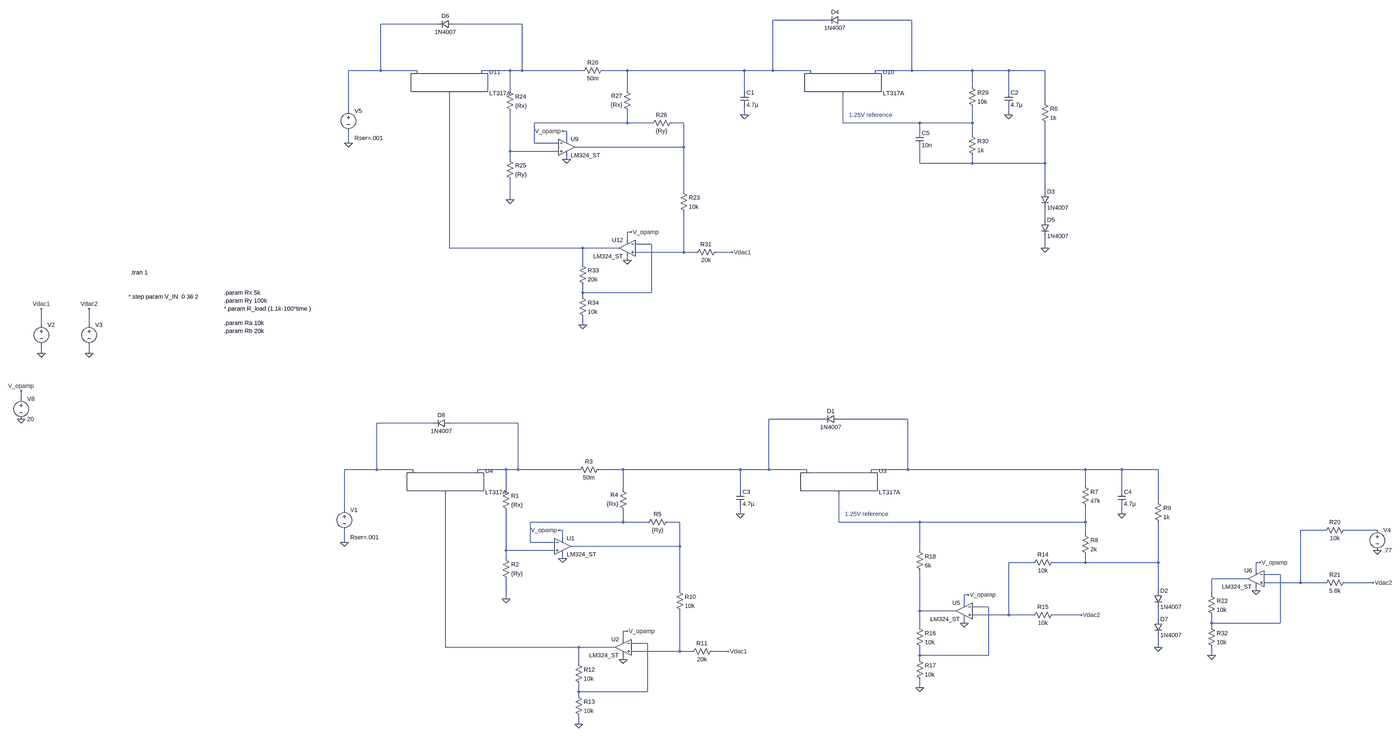
[diagram p0: schematic LDO2.asc, whole sheet]
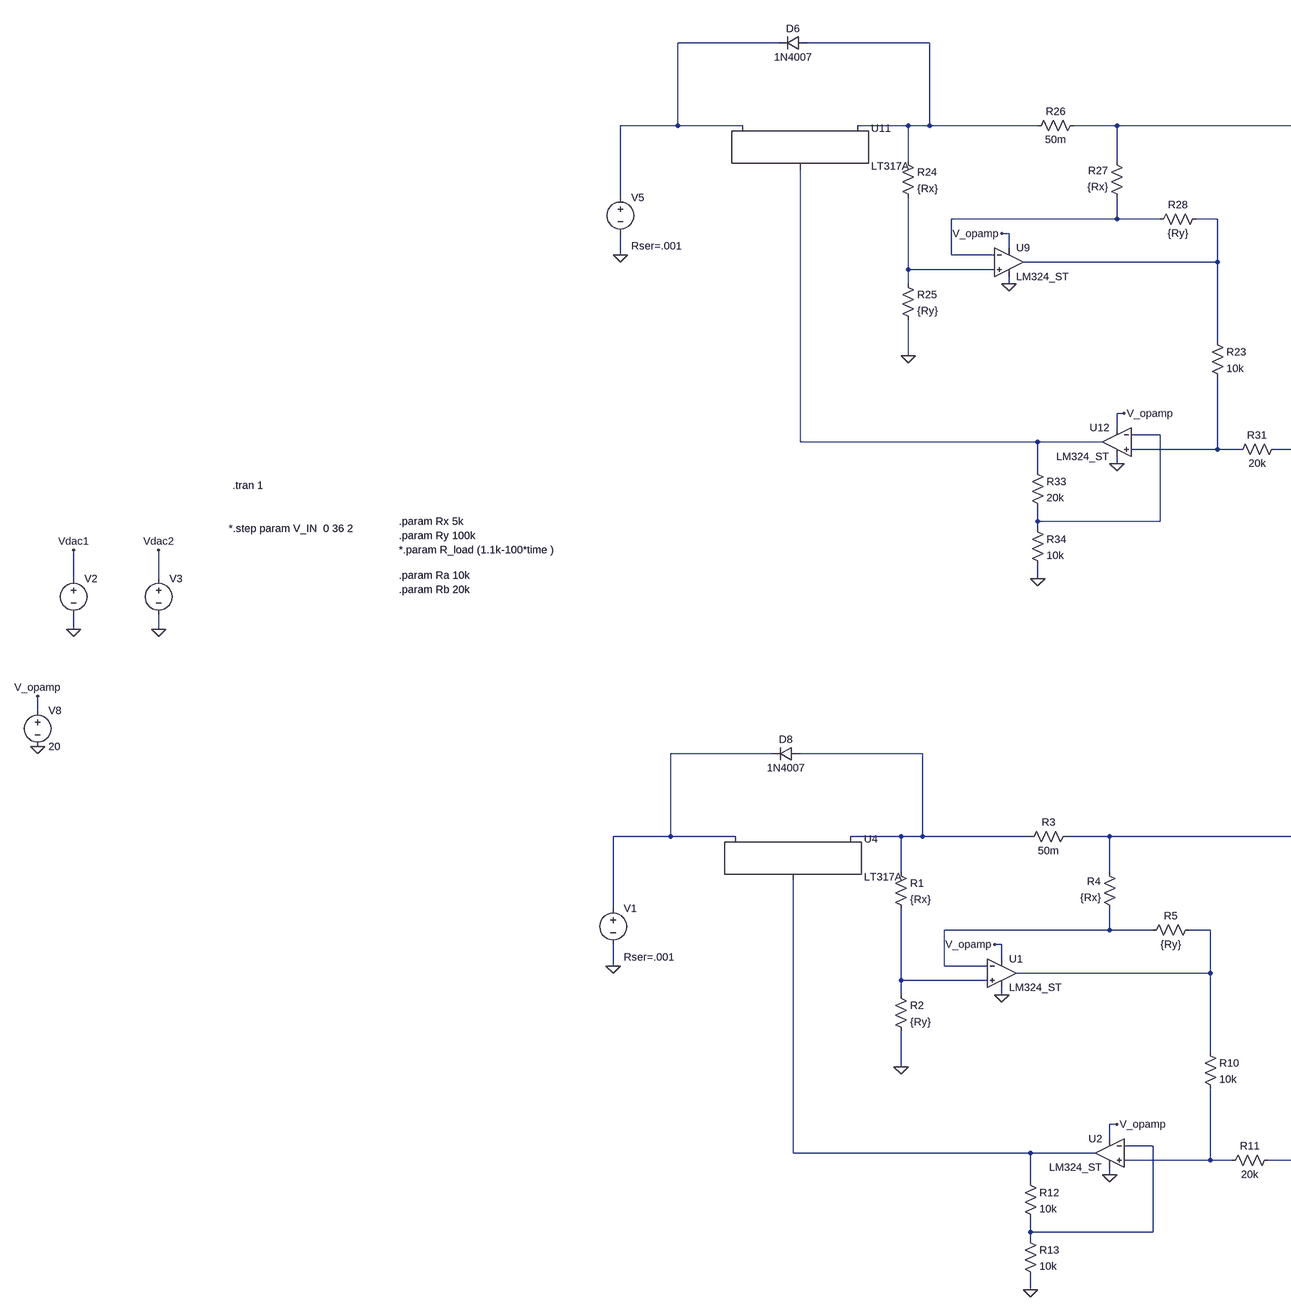
[diagram p1: schematic LDO2.asc, part, row 1 of 1, column 1 of 2]
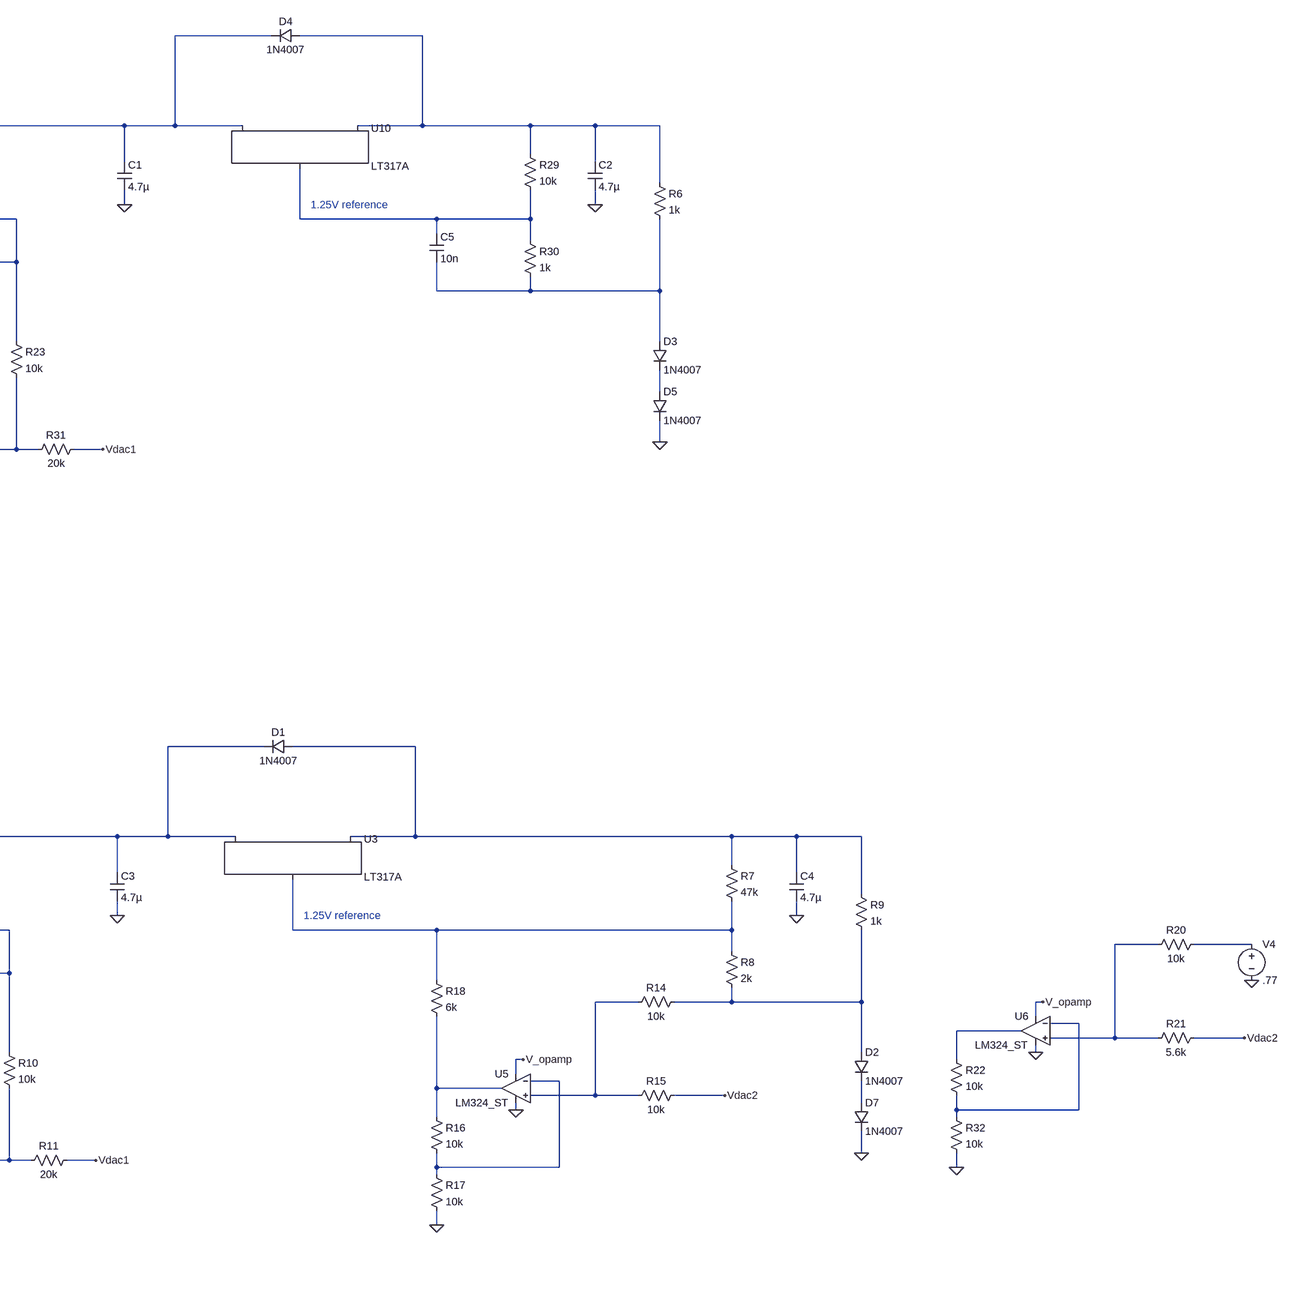
[diagram p2: schematic LDO2.asc, part, row 1 of 1, column 2 of 2]
LDO2.asc, the LTspice schematic file:
Version 4
SHEET 1 14016 4660
WIRE 3968 -384 3744 -384
WIRE 4304 -384 4032 -384
WIRE 2416 -368 2192 -368
WIRE 2752 -368 2480 -368
WIRE 2192 -144 2192 -368
WIRE 2192 -144 2064 -144
WIRE 2336 -144 2192 -144
WIRE 2704 -144 2592 -144
WIRE 2752 -144 2752 -368
WIRE 2752 -144 2704 -144
WIRE 2992 -144 2752 -144
WIRE 3168 -144 3072 -144
WIRE 3632 -144 3168 -144
WIRE 3744 -144 3744 -384
WIRE 3744 -144 3632 -144
WIRE 3904 -144 3744 -144
WIRE 4304 -144 4304 -384
WIRE 4304 -144 4160 -144
WIRE 4544 -144 4304 -144
WIRE 4688 -144 4544 -144
WIRE 4832 -144 4688 -144
WIRE 4544 -80 4544 -144
WIRE 2704 -64 2704 -144
WIRE 3168 -64 3168 -144
WIRE 3632 -64 3632 -144
WIRE 4688 -64 4688 -144
WIRE 4832 -16 4832 -144
WIRE 2064 16 2064 -144
WIRE 3632 32 3632 0
WIRE 4688 32 4688 0
WIRE 3168 64 3168 16
WIRE 3168 64 2800 64
WIRE 3264 64 3168 64
WIRE 3392 64 3344 64
WIRE 4032 64 4032 -48
WIRE 4336 64 4032 64
WIRE 4544 64 4544 0
WIRE 4544 64 4336 64
WIRE 2928 96 2912 96
WIRE 4336 96 4336 64
WIRE 4544 112 4544 64
WIRE 2928 128 2928 96
WIRE 2064 144 2064 96
WIRE 2800 144 2800 64
WIRE 2896 144 2800 144
WIRE 3392 160 3392 64
WIRE 3392 160 2960 160
WIRE 2704 176 2704 16
WIRE 2896 176 2704 176
WIRE 2704 208 2704 176
WIRE 2928 208 2928 192
WIRE 4336 224 4336 160
WIRE 4544 224 4544 192
WIRE 4544 224 4336 224
WIRE 4832 224 4832 64
WIRE 4832 224 4544 224
WIRE 3392 336 3392 160
WIRE 4832 336 4832 224
WIRE 2704 368 2704 288
WIRE 4832 448 4832 400
WIRE 3184 496 3168 496
WIRE 3168 528 3168 496
WIRE 3264 544 3200 544
WIRE 2464 560 2464 -48
WIRE 2992 560 2464 560
WIRE 3136 560 2992 560
WIRE 4832 560 4832 512
WIRE 3392 576 3392 416
WIRE 3392 576 3200 576
WIRE 3440 576 3392 576
WIRE 3584 576 3520 576
WIRE 3168 608 3168 592
WIRE 2992 624 2992 560
WIRE 2992 736 2992 704
WIRE 3264 736 3264 544
WIRE 3264 736 2992 736
WIRE 2992 752 2992 736
WIRE 0 864 0 800
WIRE 224 864 224 800
WIRE 2992 864 2992 832
WIRE 0 976 0 944
WIRE 224 976 224 944
WIRE -80 1264 -80 1232
WIRE 3952 1344 3728 1344
WIRE 4288 1344 4016 1344
WIRE 2400 1360 2176 1360
WIRE 2736 1360 2464 1360
WIRE 2176 1584 2176 1360
WIRE 2176 1584 2048 1584
WIRE 2320 1584 2176 1584
WIRE 2688 1584 2576 1584
WIRE 2736 1584 2736 1360
WIRE 2736 1584 2688 1584
WIRE 2976 1584 2736 1584
WIRE 3152 1584 3056 1584
WIRE 3616 1584 3152 1584
WIRE 3728 1584 3728 1344
WIRE 3728 1584 3616 1584
WIRE 3888 1584 3728 1584
WIRE 4288 1584 4288 1344
WIRE 4288 1584 4144 1584
WIRE 4992 1584 4288 1584
WIRE 5136 1584 4992 1584
WIRE 5280 1584 5136 1584
WIRE 4992 1648 4992 1584
WIRE 2688 1664 2688 1584
WIRE 3152 1664 3152 1584
WIRE 3616 1664 3616 1584
WIRE 5136 1664 5136 1584
WIRE 5280 1712 5280 1584
WIRE 2048 1744 2048 1584
WIRE 3616 1760 3616 1728
WIRE 5136 1760 5136 1728
WIRE 3152 1792 3152 1744
WIRE 3152 1792 2784 1792
WIRE 3248 1792 3152 1792
WIRE 3376 1792 3328 1792
WIRE 4016 1792 4016 1680
WIRE 4336 1792 4016 1792
WIRE 4992 1792 4992 1728
WIRE 4992 1792 4336 1792
WIRE 2912 1824 2896 1824
WIRE 6336 1824 6240 1824
WIRE 6544 1824 6416 1824
WIRE 4992 1840 4992 1792
WIRE 2912 1856 2912 1824
WIRE 2048 1872 2048 1824
WIRE 2784 1872 2784 1792
WIRE 2880 1872 2784 1872
WIRE 3376 1888 3376 1792
WIRE 3376 1888 2944 1888
WIRE 2688 1904 2688 1744
WIRE 2880 1904 2688 1904
WIRE 4336 1904 4336 1792
WIRE 2688 1936 2688 1904
WIRE 2912 1936 2912 1920
WIRE 4784 1952 4688 1952
WIRE 4992 1952 4992 1920
WIRE 4992 1952 4864 1952
WIRE 5280 1952 5280 1792
WIRE 5280 1952 4992 1952
WIRE 6080 1952 6064 1952
WIRE 6064 1984 6064 1952
WIRE 6160 2000 6096 2000
WIRE 6032 2016 5888 2016
WIRE 6240 2032 6240 1824
WIRE 6240 2032 6096 2032
WIRE 6336 2032 6240 2032
WIRE 6528 2032 6416 2032
WIRE 3376 2064 3376 1888
WIRE 5280 2064 5280 1952
WIRE 6064 2064 6064 2048
WIRE 4528 2080 4512 2080
WIRE 5888 2080 5888 2016
WIRE 2688 2096 2688 2016
WIRE 4512 2112 4512 2080
WIRE 4608 2128 4544 2128
WIRE 4336 2144 4336 1984
WIRE 4480 2144 4336 2144
WIRE 4688 2160 4688 1952
WIRE 4688 2160 4544 2160
WIRE 4784 2160 4688 2160
WIRE 4976 2160 4864 2160
WIRE 5280 2176 5280 2128
WIRE 4512 2192 4512 2176
WIRE 5888 2192 5888 2160
WIRE 6160 2192 6160 2000
WIRE 6160 2192 5888 2192
WIRE 4336 2208 4336 2144
WIRE 5888 2208 5888 2192
WIRE 3168 2224 3152 2224
WIRE 3152 2256 3152 2224
WIRE 3248 2272 3184 2272
WIRE 2448 2288 2448 1680
WIRE 2976 2288 2448 2288
WIRE 3120 2288 2976 2288
WIRE 5280 2288 5280 2240
WIRE 3376 2304 3376 2144
WIRE 3376 2304 3184 2304
WIRE 3424 2304 3376 2304
WIRE 3568 2304 3504 2304
WIRE 4336 2320 4336 2288
WIRE 4608 2320 4608 2128
WIRE 4608 2320 4336 2320
WIRE 5888 2320 5888 2288
WIRE 3152 2336 3152 2320
WIRE 4336 2336 4336 2320
WIRE 2976 2352 2976 2288
WIRE 4336 2448 4336 2416
WIRE 2976 2464 2976 2432
WIRE 3248 2464 3248 2272
WIRE 3248 2464 2976 2464
WIRE 2976 2480 2976 2464
WIRE 2976 2592 2976 2560
FLAG 0 800 Vdac1
FLAG 224 800 Vdac2
FLAG 224 976 0
FLAG 0 976 0
FLAG -80 1344 0
FLAG -80 1232 V_opamp
FLAG 2704 368 0
FLAG 2912 96 V_opamp
FLAG 2928 208 0
FLAG 2064 144 0
FLAG 3184 496 V_opamp
FLAG 3168 608 0
FLAG 3584 576 Vdac1
FLAG 4832 560 0
FLAG 3632 32 0
FLAG 4688 32 0
FLAG 2992 864 0
FLAG 2688 2096 0
FLAG 2896 1824 V_opamp
FLAG 2912 1936 0
FLAG 2048 1872 0
FLAG 3168 2224 V_opamp
FLAG 3152 2336 0
FLAG 3568 2304 Vdac1
FLAG 5280 2288 0
FLAG 3616 1760 0
FLAG 5136 1760 0
FLAG 2976 2592 0
FLAG 4528 2080 V_opamp
FLAG 4512 2192 0
FLAG 4336 2448 0
FLAG 4976 2160 Vdac2
FLAG 6080 1952 V_opamp
FLAG 6064 2064 0
FLAG 5888 2320 0
FLAG 6528 2032 Vdac2
FLAG 6544 1904 0
SYMBOL voltage 0 848 R0
WINDOW 123 0 0 Left 0
WINDOW 39 0 0 Left 0
WINDOW 3 24 96 Invisible 2
SYMATTR Value 0
SYMATTR InstName V2
SYMBOL voltage 224 848 R0
WINDOW 123 0 0 Left 0
WINDOW 39 0 0 Left 0
WINDOW 3 24 96 Invisible 2
SYMATTR InstName V3
SYMATTR Value PWL(0 0 .9 2.5)
SYMBOL voltage -80 1248 R0
WINDOW 123 0 0 Left 0
WINDOW 39 0 0 Left 0
SYMATTR InstName V8
SYMATTR Value 20
SYMBOL res 2688 -80 R0
SYMATTR InstName R24
SYMATTR Value {Rx}
SYMBOL res 2688 192 R0
SYMATTR InstName R25
SYMATTR Value {Ry}
SYMBOL res 2976 -128 R270
WINDOW 0 32 56 VTop 2
WINDOW 3 0 56 VBottom 2
SYMATTR InstName R26
SYMATTR Value 50m
SYMBOL res 3184 32 R180
WINDOW 0 36 76 Left 2
WINDOW 3 36 40 Left 2
SYMATTR InstName R27
SYMATTR Value {Rx}
SYMBOL res 3248 80 R270
WINDOW 0 32 56 VTop 2
WINDOW 3 0 56 VBottom 2
SYMATTR InstName R28
SYMATTR Value {Ry}
SYMBOL ZZZ\\OpAmp\\LM324_ST 2928 160 R0
SYMATTR InstName U9
SYMBOL diode 4032 -400 R90
WINDOW 0 0 32 VBottom 2
WINDOW 3 32 32 VTop 2
SYMATTR InstName D4
SYMATTR Value 1N4007
SYMBOL res 4528 -96 R0
SYMATTR InstName R29
SYMATTR Value 10k
SYMBOL res 4528 96 R0
SYMATTR InstName R30
SYMATTR Value 1k
SYMBOL voltage 2064 0 R0
WINDOW 123 0 0 Left 0
WINDOW 39 24 124 Left 2
WINDOW 3 24 96 Invisible 2
SYMATTR SpiceLine Rser=.001
SYMATTR Value 30
SYMATTR InstName V5
SYMBOL ZZZ\\OpAmp\\LM324_ST 3168 560 M0
SYMATTR InstName U12
SYMBOL res 4816 -32 R0
SYMATTR InstName R6
SYMATTR Value 1k
SYMBOL PowerProducts\\LT317A 4032 -144 R0
SYMATTR InstName U10
SYMBOL PowerProducts\\LT317A 2464 -144 R0
SYMATTR InstName U11
SYMBOL diode 4816 336 R0
SYMATTR InstName D3
SYMATTR Value 1N4007
SYMBOL diode 4816 448 R0
SYMATTR InstName D5
SYMATTR Value 1N4007
SYMBOL diode 2480 -384 R90
WINDOW 0 0 32 VBottom 2
WINDOW 3 32 32 VTop 2
SYMATTR InstName D6
SYMATTR Value 1N4007
SYMBOL cap 3616 -64 R0
SYMATTR InstName C1
SYMATTR Value 4.7µ
SYMBOL cap 4672 -64 R0
SYMATTR InstName C2
SYMATTR Value 4.7µ
SYMBOL cap 4320 96 R0
SYMATTR InstName C5
SYMATTR Value 10n
SYMBOL res 3376 320 R0
SYMATTR InstName R23
SYMATTR Value 10k
SYMBOL res 3536 560 R90
WINDOW 0 0 56 VBottom 2
WINDOW 3 32 56 VTop 2
SYMATTR InstName R31
SYMATTR Value 20k
SYMBOL res 2976 608 R0
SYMATTR InstName R33
SYMATTR Value 20k
SYMBOL res 2976 736 R0
SYMATTR InstName R34
SYMATTR Value 10k
SYMBOL res 2672 1648 R0
SYMATTR InstName R1
SYMATTR Value {Rx}
SYMBOL res 2672 1920 R0
SYMATTR InstName R2
SYMATTR Value {Ry}
SYMBOL res 2960 1600 R270
WINDOW 0 32 56 VTop 2
WINDOW 3 0 56 VBottom 2
SYMATTR InstName R3
SYMATTR Value 50m
SYMBOL res 3168 1760 R180
WINDOW 0 36 76 Left 2
WINDOW 3 36 40 Left 2
SYMATTR InstName R4
SYMATTR Value {Rx}
SYMBOL res 3232 1808 R270
WINDOW 0 32 56 VTop 2
WINDOW 3 0 56 VBottom 2
SYMATTR InstName R5
SYMATTR Value {Ry}
SYMBOL ZZZ\\OpAmp\\LM324_ST 2912 1888 R0
SYMATTR InstName U1
SYMBOL diode 4016 1328 R90
WINDOW 0 0 32 VBottom 2
WINDOW 3 32 32 VTop 2
SYMATTR InstName D1
SYMATTR Value 1N4007
SYMBOL res 4976 1632 R0
SYMATTR InstName R7
SYMATTR Value 47k
SYMBOL res 4976 1824 R0
SYMATTR InstName R8
SYMATTR Value 2k
SYMBOL voltage 2048 1728 R0
WINDOW 123 0 0 Left 0
WINDOW 39 24 124 Left 2
WINDOW 3 24 96 Invisible 2
SYMATTR SpiceLine Rser=.001
SYMATTR Value 30
SYMATTR InstName V1
SYMBOL ZZZ\\OpAmp\\LM324_ST 3152 2288 M0
SYMATTR InstName U2
SYMBOL res 5264 1696 R0
SYMATTR InstName R9
SYMATTR Value 1k
SYMBOL PowerProducts\\LT317A 4016 1584 R0
SYMATTR InstName U3
SYMBOL PowerProducts\\LT317A 2448 1584 R0
SYMATTR InstName U4
SYMBOL diode 5264 2064 R0
SYMATTR InstName D2
SYMATTR Value 1N4007
SYMBOL diode 5264 2176 R0
SYMATTR InstName D7
SYMATTR Value 1N4007
SYMBOL diode 2464 1344 R90
WINDOW 0 0 32 VBottom 2
WINDOW 3 32 32 VTop 2
SYMATTR InstName D8
SYMATTR Value 1N4007
SYMBOL cap 3600 1664 R0
SYMATTR InstName C3
SYMATTR Value 4.7µ
SYMBOL cap 5120 1664 R0
SYMATTR InstName C4
SYMATTR Value 4.7µ
SYMBOL res 3360 2048 R0
SYMATTR InstName R10
SYMATTR Value 10k
SYMBOL res 3520 2288 R90
WINDOW 0 0 56 VBottom 2
WINDOW 3 32 56 VTop 2
SYMATTR InstName R11
SYMATTR Value 20k
SYMBOL res 2960 2336 R0
SYMATTR InstName R12
SYMATTR Value 10k
SYMBOL res 2960 2464 R0
SYMATTR InstName R13
SYMATTR Value 10k
SYMBOL res 4880 1936 R90
WINDOW 0 0 56 VBottom 2
WINDOW 3 32 56 VTop 2
SYMATTR InstName R14
SYMATTR Value 10k
SYMBOL res 4880 2144 R90
WINDOW 0 0 56 VBottom 2
WINDOW 3 32 56 VTop 2
SYMATTR InstName R15
SYMATTR Value 10k
SYMBOL ZZZ\\OpAmp\\LM324_ST 4512 2144 M0
SYMATTR InstName U5
SYMBOL res 4320 2192 R0
SYMATTR InstName R16
SYMATTR Value 10k
SYMBOL res 4320 2320 R0
SYMATTR InstName R17
SYMATTR Value 10k
SYMBOL res 4320 1888 R0
SYMATTR InstName R18
SYMATTR Value 6k
SYMBOL res 6432 1808 R90
WINDOW 0 0 56 VBottom 2
WINDOW 3 32 56 VTop 2
SYMATTR InstName R20
SYMATTR Value 10k
SYMBOL res 6432 2016 R90
WINDOW 0 0 56 VBottom 2
WINDOW 3 32 56 VTop 2
SYMATTR InstName R21
SYMATTR Value 5.6k
SYMBOL ZZZ\\OpAmp\\LM324_ST 6064 2016 M0
SYMATTR InstName U6
SYMBOL res 5872 2064 R0
SYMATTR InstName R22
SYMATTR Value 10k
SYMBOL res 5872 2192 R0
SYMATTR InstName R32
SYMATTR Value 10k
SYMBOL voltage 6544 1808 R0
WINDOW 123 0 0 Left 0
WINDOW 39 0 0 Left 0
SYMATTR InstName V4
SYMATTR Value .77
TEXT 520 656 Left 2 !.tran 1
TEXT 512 752 Left 2 !*.step param V_IN  0 36 2
TEXT 1000 736 Left 2 !.param Rx 5k
TEXT 1000 768 Left 2 !.param Ry 100k
TEXT 1000 800 Left 2 !*.param R_load (1.1k-100*time )
TEXT 1000 856 Left 2 !.param Ra 10k
TEXT 1000 888 Left 2 !.param Rb 20k
TEXT 4056 32 Left 2 ;1.25V reference
TEXT 4040 1760 Left 2 ;1.25V reference

The netlist it stands for:
* LDO2.asc
V2 Vdac1 0 0
V3 Vdac2 0 PWL(0 0 .9 2.5)
V8 V_opamp 0 20
R24 N004 N008 {Rx}
R25 N008 0 {Ry}
R26 N004 N001 50m
R27 N005 N001 {Rx}
R28 N005 N006 {Ry}
* U9: LM324_ST (symbol ZZZ\OpAmp\LM324_ST not available, pins judged from their places): In+=N008 In-=N005 V+=V_opamp V-=0 OUT=N006
D4 N002 N001 1N4007
R29 N002 N007 10k
R30 N007 N009 1k
V5 N003 0 30 Rser=.001
* U12: LM324_ST (symbol ZZZ\OpAmp\LM324_ST not available, pins judged from their places): In+=N013 In-=N011 V+=V_opamp V-=0 OUT=N012
R6 N002 N009 1k
XU10 N007 N002 N001 LT317A
XU11 N012 N004 N003 LT317A
D3 N009 N010 1N4007
D5 N010 0 1N4007
D6 N004 N003 1N4007
C1 N001 0 4.7µ
C2 N002 0 4.7µ
C5 N007 N009 10n
R23 N006 N013 10k
R31 Vdac1 N013 20k
R33 N012 N011 20k
R34 N011 0 10k
R1 N017 N023 {Rx}
R2 N023 0 {Ry}
R3 N017 N014 50m
R4 N018 N014 {Rx}
R5 N018 N019 {Ry}
* U1: LM324_ST (symbol ZZZ\OpAmp\LM324_ST not available, pins judged from their places): In+=N023 In-=N018 V+=V_opamp V-=0 OUT=N019
D1 N015 N014 1N4007
R7 N015 N020 47k
R8 N020 N025 2k
V1 N016 0 30 Rser=.001
* U2: LM324_ST (symbol ZZZ\OpAmp\LM324_ST not available, pins judged from their places): In+=N033 In-=N031 V+=V_opamp V-=0 OUT=N032
R9 N015 N025 1k
XU3 N020 N015 N014 LT317A
XU4 N032 N017 N016 LT317A
D2 N025 N030 1N4007
D7 N030 0 1N4007
D8 N017 N016 1N4007
C3 N014 0 4.7µ
C4 N015 0 4.7µ
R10 N019 N033 10k
R11 Vdac1 N033 20k
R12 N032 N031 10k
R13 N031 0 10k
R14 N025 N024 10k
R15 Vdac2 N024 10k
* U5: LM324_ST (symbol ZZZ\OpAmp\LM324_ST not available, pins judged from their places): In+=N024 In-=N028 V+=V_opamp V-=0 OUT=N029
R16 N029 N028 10k
R17 N028 0 10k
R18 N020 N029 6k
R20 N022 N021 10k
R21 Vdac2 N021 5.6k
* U6: LM324_ST (symbol ZZZ\OpAmp\LM324_ST not available, pins judged from their places): In+=N021 In-=N026 V+=V_opamp V-=0 OUT=N027
R22 N027 N026 10k
R32 N026 0 10k
V4 N022 0 .77
.model D D
.lib standard.dio
.tran 1
*.step param V_IN  0 36 2
.param Rx 5k
.param Ry 100k
*.param R_load (1.1k-100*time )
.param Ra 10k
.param Rb 20k
* 1.25V reference
* 1.25V reference
.lib LTC.lib
.backanno
.end